# Altium schematic sheet ChipSelectCS_ICM42670-P__Schematic__Sheet_1_2024-09-11.schdoc
size 253 x 111 mm
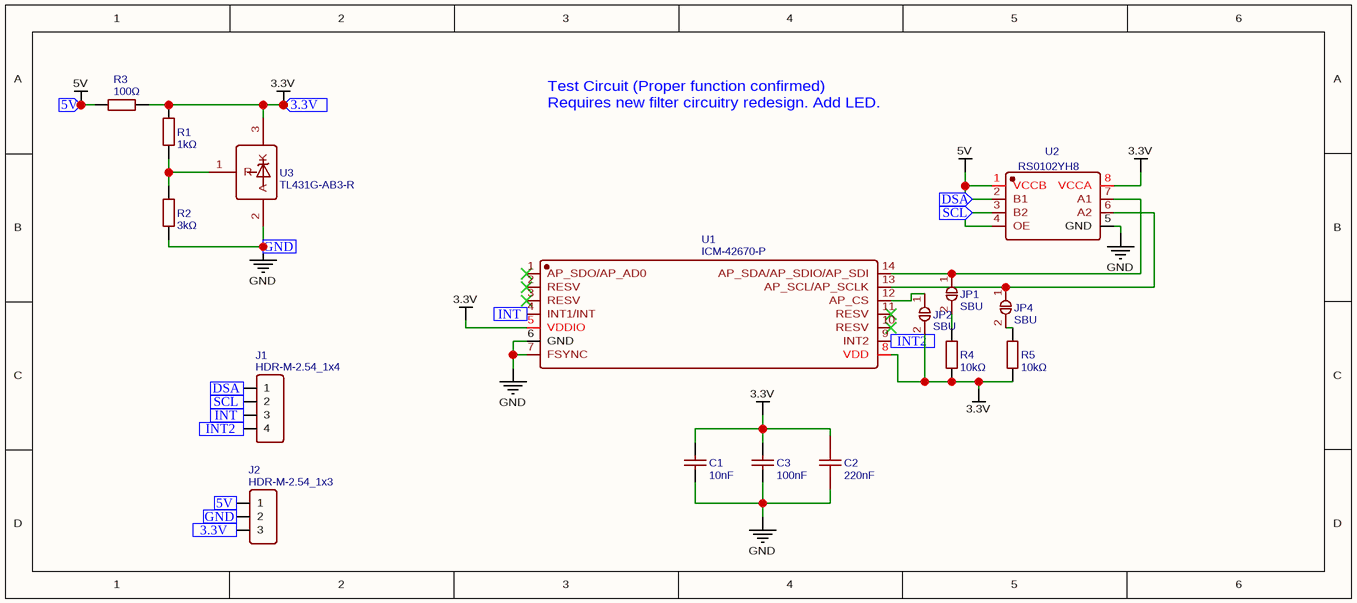
[diagram p0: ChipSelectCS_ICM42670-P__Schematic__Sheet_1_2024-09-11.schdoc]

## Parts
C1  10nF  [C1206]
C2  220nF  [C1206]
C3  100nF  [C1206]
J1  HDR-M-2.54_1x4  [HDR-M-2.54_1X4]
J2  HDR-M-2.54_1x3  [HDR-M-2.54_1X3]
JP1  SBU  [SOLDER BRIDGE 2P UNBRIDGED]
JP2  SBU  [SOLDER BRIDGE 2P UNBRIDGED]
JP4  SBU  [SOLDER BRIDGE 2P UNBRIDGED]
R1  1kΩ  [R1206]
R2  3kΩ  [R1206]
R3  100Ω  [R1206]
R4  10kΩ  [R1206]
R5  10kΩ  [R1206]
U1  ICM-42670-P  [LGA-14_L3.0-W2.5-P0.50-TL_QMI8658A]
U2  RS0102YH8  [SOT-23-8_L3.0-W1.7-P0.65-LS2.8-BL]
U3  TL431G-AB3-R  [SOT-89-3_L4.5-W2.5-P1.50-LS4.2-BR]

## Ports
3.3V (in), 5V (in), DSA (in), GND (in), INT2 (in), INT (in), SCL (in)

## Nets
3.3V: C1.2 C2.2 C3.2 J2.3 JP2.2(B) R1.2 R3.2 R4.1 R5.1 U1.5(VDDIO) U1.8(VDD) U2.8(VCCA) U3.3(K) ; port 3.3V
5V: J2.1 R3.1 U2.1(VCCB) U2.4(OE) ; port 5V
GND: C1.1 C2.1 C3.1 J2.2 R2.1 U1.6(GND) U1.7(FSYNC) U2.5(GND) U3.2(A) ; port GND
DSA: J1.1 U2.2(B1) ; port DSA
INT: J1.3 U1.4(INT1/INT) ; port INT
INT2: J1.4 U1.9(INT2) ; port INT2
SCL: J1.2 U2.3(B2) ; port SCL
NetJP1_1: JP1.1(A) U1.14(AP_SDA/AP_SDIO/AP_SDI) U2.7(A1)
NetJP1_2: JP1.2(B) R4.2
NetJP2_1: JP2.1(A) U1.12(AP_CS)
NetJP4_1: JP4.1(A) U1.13(AP_SCL/AP_SCLK) U2.6(A2)
NetJP4_2: JP4.2(B) R5.2
NetR1_1: R1.1 R2.2 U3.1(R)

Not connected (* = marked no-connect by the designer): U1 1(AP_SDO/AP_AD0)* 2(RESV)* 3(RESV)* 10(RESV)* 11(RESV)*

## Notes on the sheet
- Test Circuit (Proper function confirmed)
  Requires new filter circuitry redesign. Add LED.

## Library data of the parts
C1 = 10nF: Manufacturer: FH(风华); Manufacturer Part: 1206B103K102NT; nameAlias: Value; Supplier: LCSC; Supplier Part: C9194; JLCPCB Part Class: Extended Part; spicePre: C; spiceSymbolName: 1206B103K102NT
C2 = 220nF: Manufacturer: CCTC(三环); Manufacturer Part: TCC1206X7R224K500DT; nameAlias: Value; Contributor: LCSC; Supplier: LCSC; Supplier Part: C377090; JLCPCB Part Class: Extended Part; spicePre: C; spiceSymbolName: TCC1206X7R224K500DT
C3 = 100nF: Manufacturer: FH(风华); Manufacturer Part: 1206B104K101NT; nameAlias: Value; Supplier: LCSC; Supplier Part: C110255; JLCPCB Part Class: Extended Part; spicePre: C; spiceSymbolName: 1206B104K101NT
J1 = HDR-M-2.54_1x4: Contributor: LCEDA_Lib; Supplier Part: C124378; Supplier: LCSC; spicePre: J; spiceSymbolName: HDR-M-2.54_1x4
J2 = HDR-M-2.54_1x3: Contributor: LCEDA_Lib; Supplier Part: C180248; Supplier: LCSC; spicePre: J; spiceSymbolName: HDR-M-2.54_1x3
JP1 JP2 JP4 = SBU: Manufacturer Part: DNP; Contributor: sebif2020; Manufacturer: DNP; spicePre: J; spiceSymbolName: SBU
R1 = 1kΩ: Manufacturer: UNI-ROYAL(厚声); Manufacturer Part: 1206W4F1001T5E; nameAlias: Value; Supplier: LCSC; Supplier Part: C4410; JLCPCB Part Class: Basic Part; spicePre: R; spiceSymbolName: 1206W4F1001T5E
R2 = 3kΩ: Manufacturer: UNI-ROYAL(厚声); Manufacturer Part: 1206W4F3001T5E; nameAlias: Value; Supplier: LCSC; Supplier Part: C18012; JLCPCB Part Class: Extended Part; spicePre: R; spiceSymbolName: 1206W4F3001T5E
R3 = 100Ω: Manufacturer: UNI-ROYAL(厚声); Manufacturer Part: 1206W4F1000T5E; nameAlias: Value; Supplier: LCSC; Supplier Part: C17901; JLCPCB Part Class: Basic Part; spicePre: R; spiceSymbolName: 1206W4F1000T5E
R4 R5 = 10kΩ: Manufacturer: UNI-ROYAL(厚声); Manufacturer Part: 1206W4J0103T5E; nameAlias: Value; Supplier: LCSC; Supplier Part: C1489; JLCPCB Part Class: Extended Part; spicePre: R; spiceSymbolName: 1206W4J0103T5E
U1 = ICM-42670-P: Manufacturer: TDK InvenSense(应美盛); Contributor: lcsc; Supplier: LCSC; Supplier Part: C3288646; Manufacturer Part: ICM-42670-P; JLCPCB Part Class: Extended Part; spicePre: U; spiceSymbolName: ICM-42670-P
U2 = RS0102YH8: Manufacturer: RUNIC(润石); Contributor: LCSC; Supplier: LCSC; Supplier Part: C783414; Manufacturer Part: RS0102YH8; JLCPCB Part Class: Extended Part; spicePre: U; spiceSymbolName: RS0102YH8
U3 = TL431G-AB3-R: Manufacturer: UTC(友顺); Supplier: LCSC; Manufacturer Part: TL431G-AB3-R; Supplier Part: C71128; JLCPCB Part Class: Extended Part; spicePre: U; spiceSymbolName: TL431G-AB3-R